# EAGLE schematic MainAutobike (EAGLE 7.3.0)

## Sheet 1 of 6
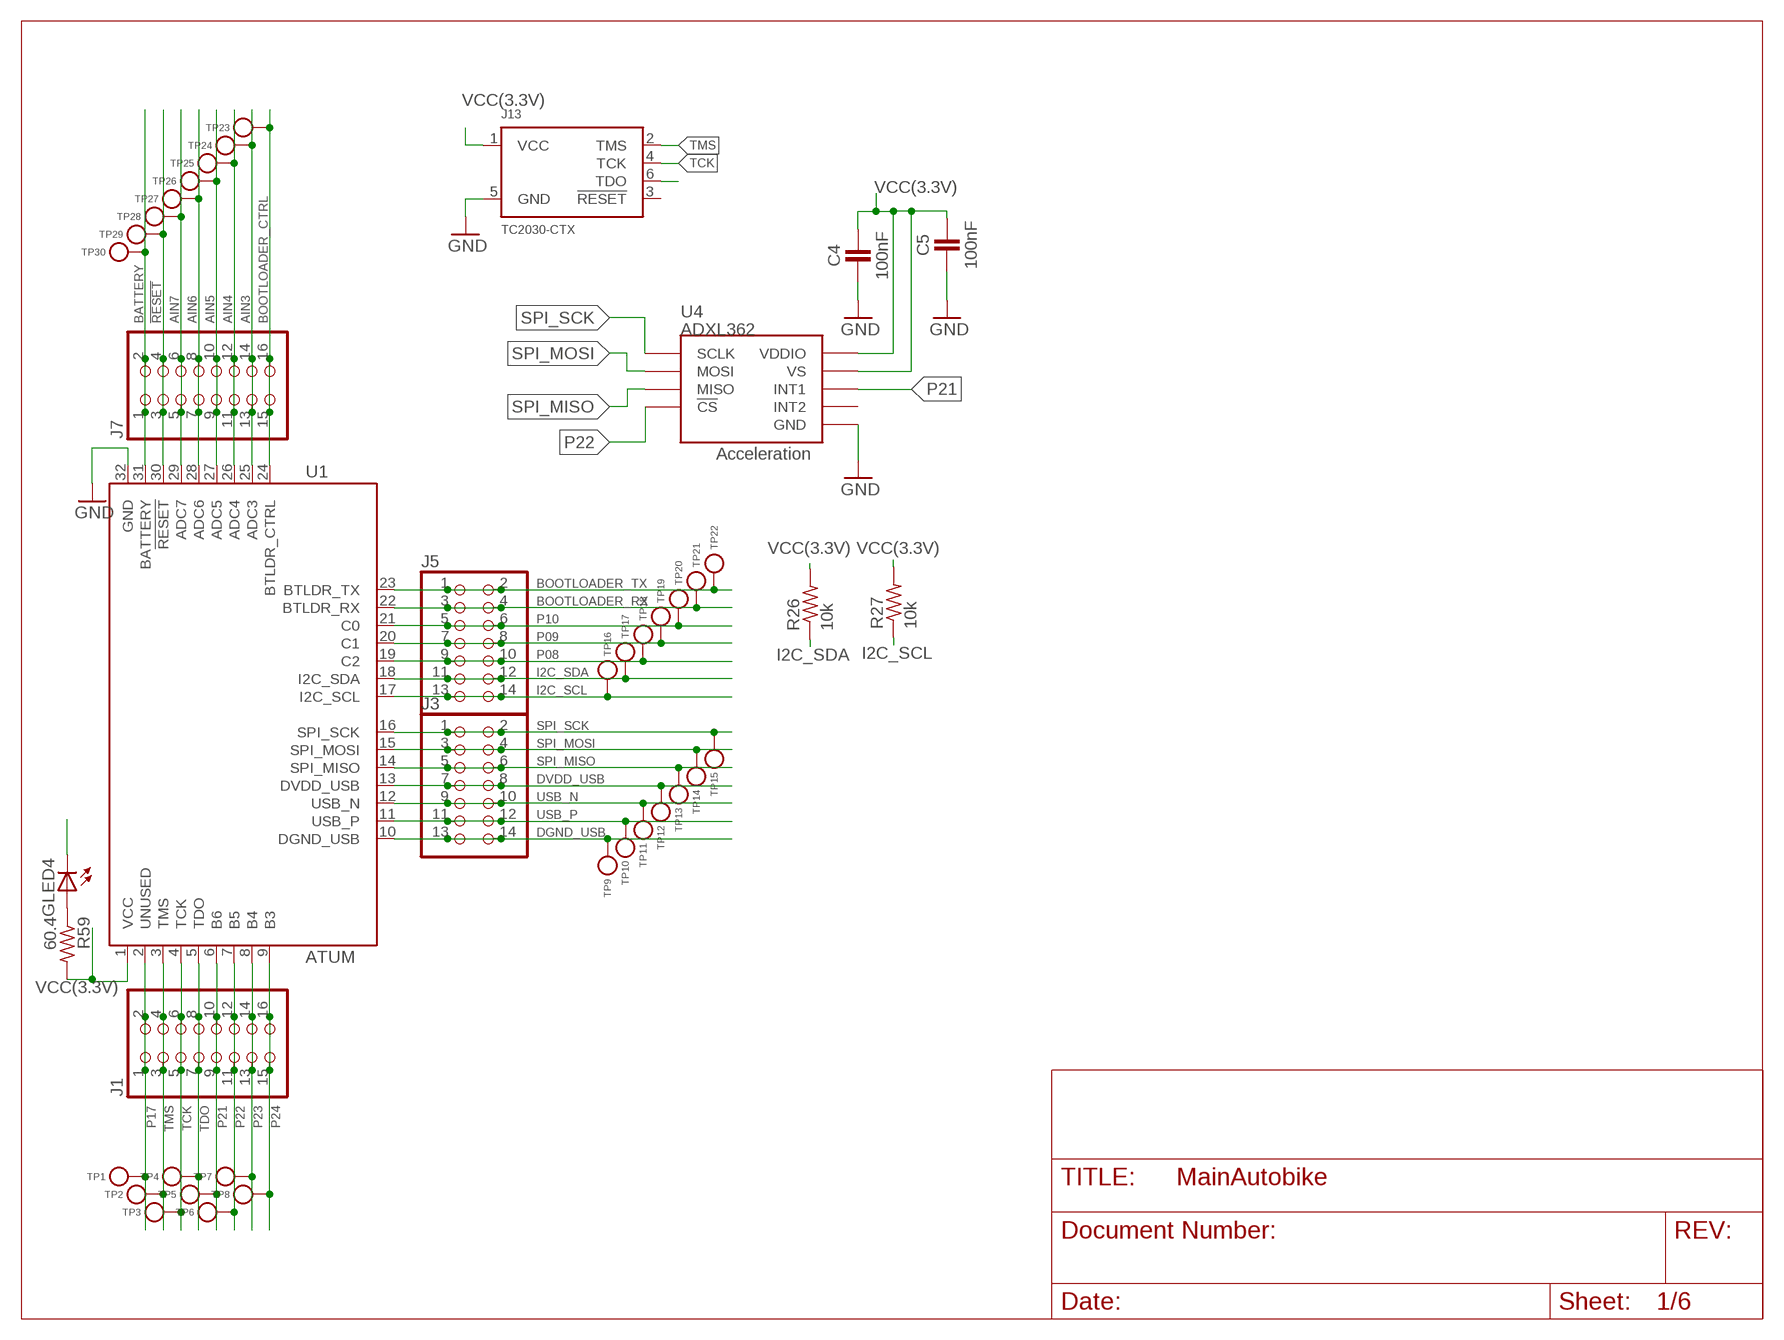
[diagram p0: schematic, sheet 1]

### Parts
C4  100nF  CAPACITOR  [0402_CAP]
C5  100nF  CAPACITOR  [0402_CAP]
GLED4  LEDCHIP-LED0603  [CHIP-LED0603]
J1  PINHD-2X8  [2X08]
J3  PINHD-2X7  [2X07]
J5  PINHD-2X7  [2X07]
J7  PINHD-2X8  [2X08]
J13  TC2030-CTX  [TC2030-IDC]
R26  10k  R-US_R0603  [R0603]
R27  10k  R-US_R0603  [R0603]
R59  60.4  R-US_R0402  [R0402]
TP1  TEST_POINT_0.040IN  [TESTPOINT_0.040IN]
TP2  TEST_POINT_0.040IN  [TESTPOINT_0.040IN]
TP3  TEST_POINT_0.040IN  [TESTPOINT_0.040IN]
TP4  TEST_POINT_0.040IN  [TESTPOINT_0.040IN]
TP5  TEST_POINT_0.040IN  [TESTPOINT_0.040IN]
TP6  TEST_POINT_0.040IN  [TESTPOINT_0.040IN]
TP7  TEST_POINT_0.040IN  [TESTPOINT_0.040IN]
TP8  TEST_POINT_0.040IN  [TESTPOINT_0.040IN]
TP9  TEST_POINT_0.040IN  [TESTPOINT_0.040IN]
TP10  TEST_POINT_0.040IN  [TESTPOINT_0.040IN]
TP11  TEST_POINT_0.040IN  [TESTPOINT_0.040IN]
TP12  TEST_POINT_0.040IN  [TESTPOINT_0.040IN]
TP13  TEST_POINT_0.040IN  [TESTPOINT_0.040IN]
TP14  TEST_POINT_0.040IN  [TESTPOINT_0.040IN]
TP15  TEST_POINT_0.040IN  [TESTPOINT_0.040IN]
TP16  TEST_POINT_0.040IN  [TESTPOINT_0.040IN]
TP17  TEST_POINT_0.040IN  [TESTPOINT_0.040IN]
TP18  TEST_POINT_0.040IN  [TESTPOINT_0.040IN]
TP19  TEST_POINT_0.040IN  [TESTPOINT_0.040IN]
TP20  TEST_POINT_0.040IN  [TESTPOINT_0.040IN]
TP21  TEST_POINT_0.040IN  [TESTPOINT_0.040IN]
TP22  TEST_POINT_0.040IN  [TESTPOINT_0.040IN]
TP23  TEST_POINT_0.040IN  [TESTPOINT_0.040IN]
TP24  TEST_POINT_0.040IN  [TESTPOINT_0.040IN]
TP25  TEST_POINT_0.040IN  [TESTPOINT_0.040IN]
TP26  TEST_POINT_0.040IN  [TESTPOINT_0.040IN]
TP27  TEST_POINT_0.040IN  [TESTPOINT_0.040IN]
TP28  TEST_POINT_0.040IN  [TESTPOINT_0.040IN]
TP29  TEST_POINT_0.040IN  [TESTPOINT_0.040IN]
TP30  TEST_POINT_0.040IN  [TESTPOINT_0.040IN]
U1  ATUM  [ATUM]
U4  ADXL362  [ADXL362]

### Nets
!RESET: J7.3 J7.4 TP29.TESTPOINT U1.30(!RESET)
AIN3: J7.13 J7.14 TP24.TESTPOINT U1.25(ADC3) ; also sheet 3
AIN4: J7.11 J7.12 TP25.TESTPOINT U1.26(ADC4) ; also sheet 3
AIN5: J7.9 J7.10 TP26.TESTPOINT U1.27(ADC5) ; also sheet 5
AIN6: J7.7 J7.8 TP27.TESTPOINT U1.28(ADC6) ; also sheet 5
AIN7: J7.5 J7.6 TP28.TESTPOINT U1.29(ADC7) ; also sheet 5
BATTERY: J7.1 J7.2 TP30.TESTPOINT U1.31(BATTERY)
BOOTLOADER_CTRL: J7.15 J7.16 TP23.TESTPOINT U1.24(BTLDR_CTRL)
BOOTLOADER_RX: J5.3 J5.4 TP21.TESTPOINT U1.22(BTLDR_RX)
BOOTLOADER_TX: J5.1 J5.2 TP22.TESTPOINT U1.23(BTLDR_TX)
DGND_USB: J3.13 J3.14 TP9.TESTPOINT U1.10(DGND_USB)
DVDD_USB: J3.7 J3.8 TP12.TESTPOINT U1.13(DVDD_USB)
GND: C4.2 C5.2 GLED4.C J13.5(GND) U1.32(GND) U4.P$12(GND) U4.P$13(GND) U4.P$16(GND) ; also sheet 2,3,4,5
I2C_SCL: J5.13 J5.14 R27.1 TP16.TESTPOINT U1.17(I2C_SCL) ; also sheet 2,3
I2C_SDA: J5.11 J5.12 R26.1 TP17.TESTPOINT U1.18(I2C_SDA) ; also sheet 2,3
N$79: GLED4.A R59.1
P08: J5.9 J5.10 TP18.TESTPOINT U1.19(C2)
P09: J5.7 J5.8 TP19.TESTPOINT U1.20(C1) ; also sheet 3
P10: J5.5 J5.6 TP20.TESTPOINT U1.21(C0) ; also sheet 3
P17: J1.1 J1.2 TP1.TESTPOINT U1.2(UNUSED)
P21: J1.9 J1.10 TP5.TESTPOINT U1.6(B6) U4.P$11(INT1)
P22: J1.11 J1.12 TP6.TESTPOINT U1.7(B5) U4.P$8(!CS)
P23: J1.13 J1.14 TP7.TESTPOINT U1.8(B4)
P24: J1.15 J1.16 TP8.TESTPOINT U1.9(B3)
SPI_MISO: J3.5 J3.6 TP13.TESTPOINT U1.14(SPI_MISO) U4.P$7(MISO)
SPI_MOSI: J3.3 J3.4 TP14.TESTPOINT U1.15(SPI_MOSI) U4.P$6(MOSI)
SPI_SCK: J3.1 J3.2 TP15.TESTPOINT U1.16(SPI_SCK) U4.P$4(SCLK)
TCK: J1.5 J1.6 J13.4(TCK) TP3.TESTPOINT U1.4(TCK)
TDO: J1.7 J1.8 J13.6(TDO) TP4.TESTPOINT U1.5(TDO)
TMS: J1.3 J1.4 J13.2(TMS) TP2.TESTPOINT U1.3(TMS)
USB_N: J3.9 J3.10 TP11.TESTPOINT U1.12(USB_N)
USB_P: J3.11 J3.12 TP10.TESTPOINT U1.11(USB_P)
VCC(3.3V): C4.1 C5.1 J13.1(VCC) R26.2 R27.2 R59.2 U1.1(VCC) U4.P$1(VDDIO) U4.P$14(VS) ; also sheet 2,3,4,5
Unconnected: J13.3(!RESET) U4.P$9(INT2)

### Notes on the sheet
- Acceleration

## Sheet 2 of 6
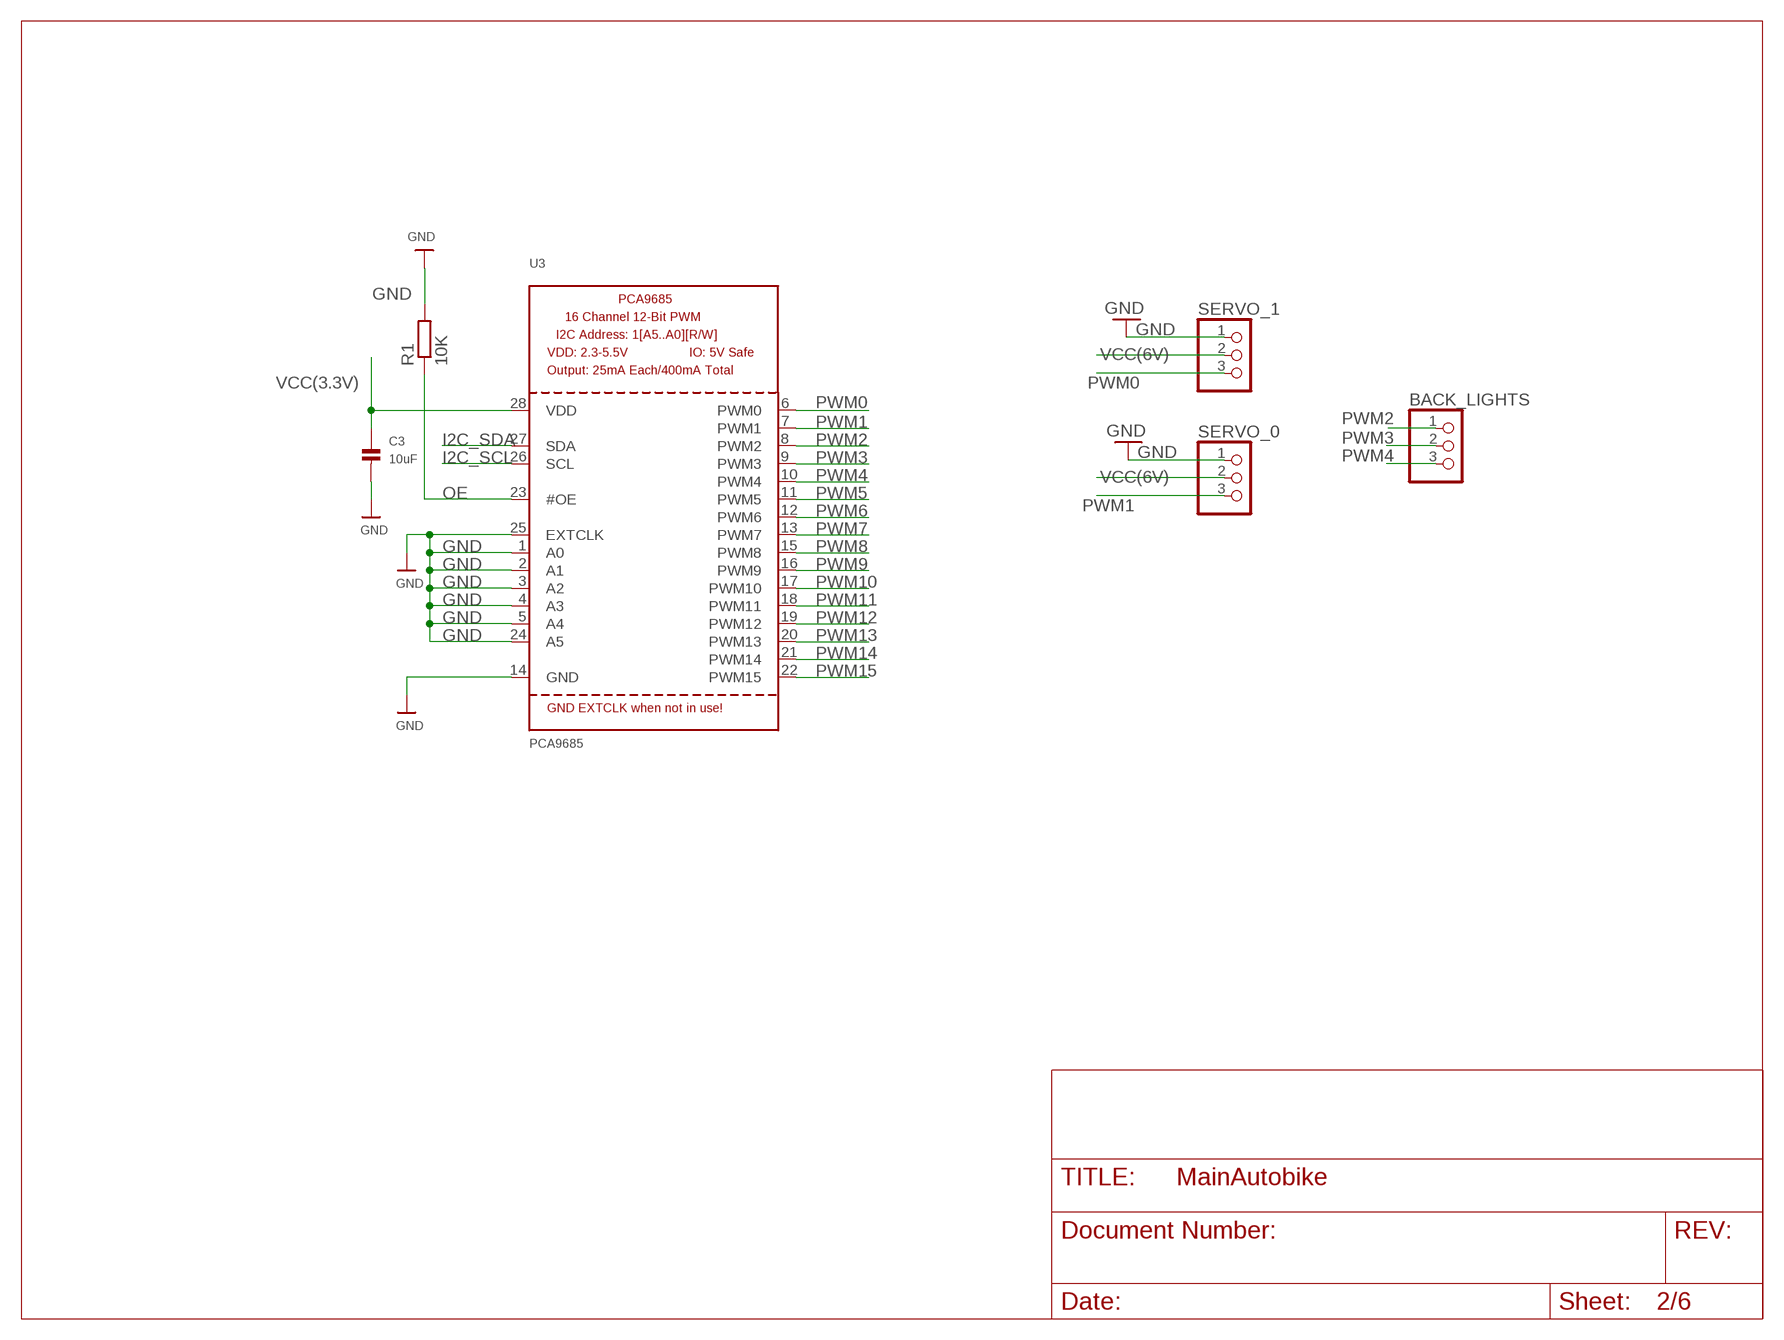
[diagram p1: schematic, sheet 2]

### Parts
BACK_LIGHTS  PINHD-1X3  [1X03]
C3  10uF  CAP_CERAMIC0805  [0805]
R1  10K  R-EU_R0603  [R0603]
SERVO_0  PINHD-1X3  [1X03]
SERVO_1  PINHD-1X3  [1X03]
U3  PCA9685  [TSSOP28]

### Nets
GND: C3.2 R1.2 SERVO_0.1 SERVO_1.1 U3.1(A0) U3.2(A1) U3.3(A2) U3.4(A3) U3.5(A4) U3.14(GND) U3.24(A5) U3.25(EXTCLK) ; also sheet 1,3,4,5
I2C_SCL: U3.26(SCL) ; also sheet 1,3
I2C_SDA: U3.27(SDA) ; also sheet 1,3
OE: R1.1 U3.23(#OE)
PWM0: SERVO_1.3 U3.6(PWM0)
PWM1: SERVO_0.3 U3.7(PWM1)
PWM2: BACK_LIGHTS.1 U3.8(PWM2)
PWM3: BACK_LIGHTS.2 U3.9(PWM3)
PWM4: BACK_LIGHTS.3 U3.10(PWM4)
PWM5: U3.11(PWM5)
PWM6: U3.12(PWM6)
PWM7: U3.13(PWM7)
PWM8: U3.15(PWM8)
PWM9: U3.16(PWM9)
PWM10: U3.17(PWM10)
PWM11: U3.18(PWM11)
PWM12: U3.19(PWM12)
PWM13: U3.20(PWM13)
PWM14: U3.21(PWM14)
PWM15: U3.22(PWM15)
VCC(3.3V): C3.1 U3.28(VDD) ; also sheet 1,3,4,5
VCC(6V): SERVO_0.2 SERVO_1.2 ; also sheet 4

## Sheet 3 of 6
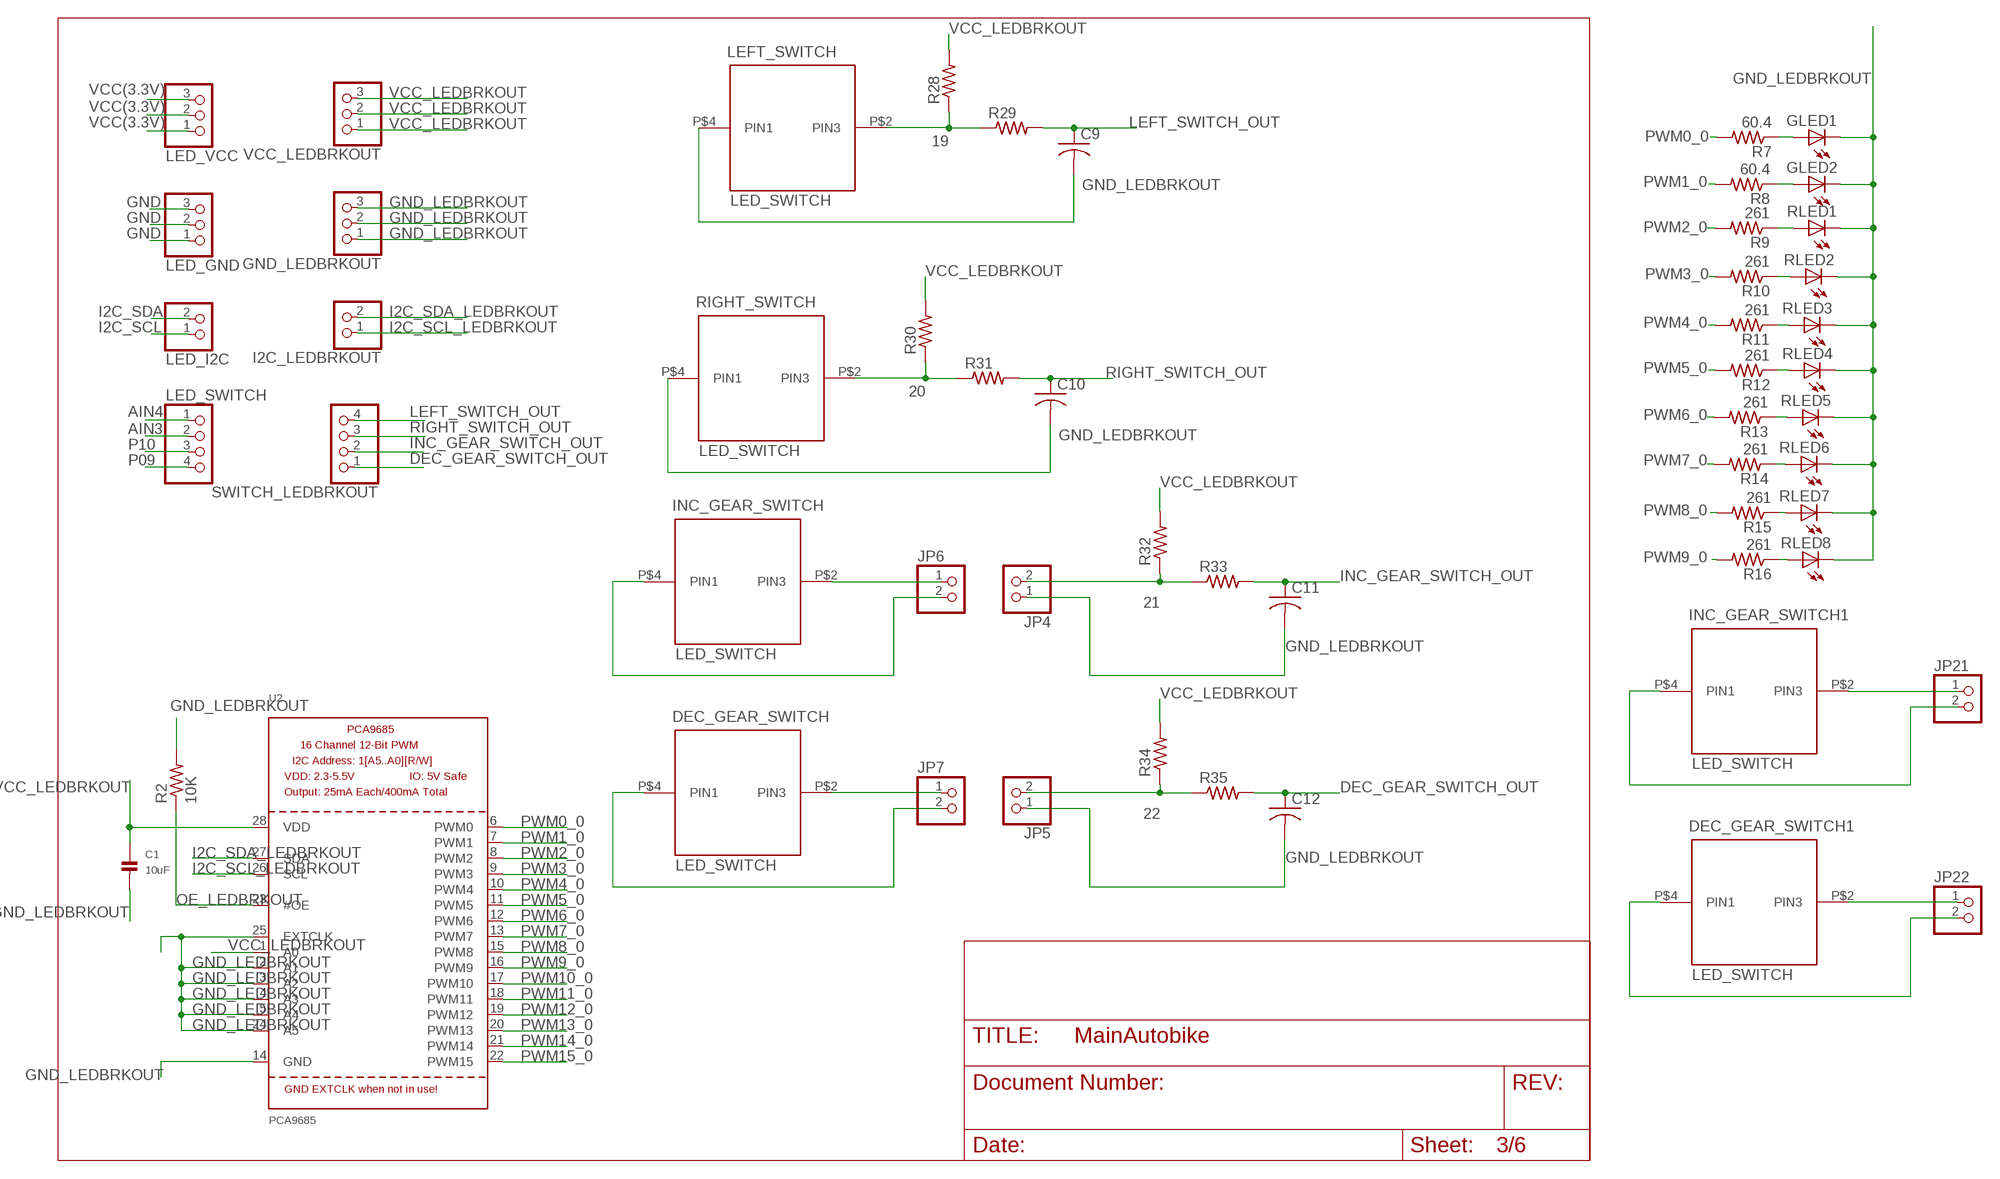
[diagram p2: schematic, sheet 3]

### Parts
C1  10uF  CAP_CERAMIC0805  [0805]
C9  C-USC0402  [C0402]
C10  C-USC0402  [C0402]
C11  C-USC0402  [C0402]
C12  C-USC0402  [C0402]
DEC_GEAR_SWITCH  LED_SWITCH  [LED_SWITCH]
DEC_GEAR_SWITCH1  LED_SWITCH  [LED_SWITCH]
GLED1  LEDCHIP-LED0603  [CHIP-LED0603]
GLED2  LEDCHIP-LED0603  [CHIP-LED0603]
GND_LEDBRKOUT  PINHD-1X3  [1X03]
I2C_LEDBRKOUT  PINHD-1X2  [1X02]
INC_GEAR_SWITCH  LED_SWITCH  [LED_SWITCH]
INC_GEAR_SWITCH1  LED_SWITCH  [LED_SWITCH]
JP4  PINHD-1X2  [1X02]
JP5  PINHD-1X2  [1X02]
JP6  PINHD-1X2  [1X02]
JP7  PINHD-1X2  [1X02]
JP21  PINHD-1X2  [1X02]
JP22  PINHD-1X2  [1X02]
LED_GND  PINHD-1X3  [1X03]
LED_I2C  PINHD-1X2  [1X02]
LED_SWITCH  PINHD-1X4  [1X04]
LED_VCC  PINHD-1X3  [1X03]
LEFT_SWITCH  LED_SWITCH  [LED_SWITCH]
R2  10K  R-US_R0603  [R0603]
R7  60.4  R-US_R0402  [R0402]
R8  60.4  R-US_R0402  [R0402]
R9  261  R-US_R0402  [R0402]
R10  261  R-US_R0402  [R0402]
R11  261  R-US_R0402  [R0402]
R12  261  R-US_R0402  [R0402]
R13  261  R-US_R0402  [R0402]
R14  261  R-US_R0402  [R0402]
R15  261  R-US_R0402  [R0402]
R16  261  R-US_R0402  [R0402]
R28  R-US_R0402  [R0402]
R29  R-US_R0402  [R0402]
R30  R-US_R0402  [R0402]
R31  R-US_R0402  [R0402]
R32  R-US_R0402  [R0402]
R33  R-US_R0402  [R0402]
R34  R-US_R0402  [R0402]
R35  R-US_R0402  [R0402]
RIGHT_SWITCH  LED_SWITCH  [LED_SWITCH]
RLED1  LEDCHIP-LED0603  [CHIP-LED0603]
RLED2  LEDCHIP-LED0603  [CHIP-LED0603]
RLED3  LEDCHIP-LED0603  [CHIP-LED0603]
RLED4  LEDCHIP-LED0603  [CHIP-LED0603]
RLED5  LEDCHIP-LED0603  [CHIP-LED0603]
RLED6  LEDCHIP-LED0603  [CHIP-LED0603]
RLED7  LEDCHIP-LED0603  [CHIP-LED0603]
RLED8  LEDCHIP-LED0603  [CHIP-LED0603]
SWITCH_LEDBRKOUT  PINHD-1X4  [1X04]
U2  PCA9685  [TSSOP28]
VCC_LEDBRKOUT  PINHD-1X3  [1X03]

### Nets
19: LEFT_SWITCH.P$2(PIN3) R28.1 R29.1
20: R30.1 R31.1 RIGHT_SWITCH.P$2(PIN3)
21: JP4.2 R32.1 R33.1
22: JP5.2 R34.1 R35.1
AIN3: LED_SWITCH.2 ; also sheet 1
AIN4: LED_SWITCH.1 ; also sheet 1
DEC_GEAR_SWITCH_OUT: C12.1 R35.2 SWITCH_LEDBRKOUT.1
GND: LED_GND.1 LED_GND.2 LED_GND.3 ; also sheet 1,2,4,5
GND_LEDBRKOUT: C1.2 C9.2 C10.2 C11.2 C12.2 GLED1.C GLED2.C GND_LEDBRKOUT.1 GND_LEDBRKOUT.2 GND_LEDBRKOUT.3 JP4.1 JP5.1 LEFT_SWITCH.P$4(PIN1) R2.2 RIGHT_SWITCH.P$4(PIN1) RLED1.C RLED2.C RLED3.C RLED4.C RLED5.C RLED6.C RLED7.C RLED8.C U2.2(A1) U2.3(A2) U2.4(A3) U2.5(A4) U2.14(GND) U2.24(A5) U2.25(EXTCLK)
I2C_SCL: LED_I2C.1 ; also sheet 1,2
I2C_SCL_LEDBRKOUT: I2C_LEDBRKOUT.1 U2.26(SCL)
I2C_SDA: LED_I2C.2 ; also sheet 1,2
I2C_SDA_LEDBRKOUT: I2C_LEDBRKOUT.2 U2.27(SDA)
INC_GEAR_SWITCH_OUT: C11.1 R33.2 SWITCH_LEDBRKOUT.2
LEFT_SWITCH_OUT: C9.1 R29.2 SWITCH_LEDBRKOUT.4
N$1: R16.1 RLED8.A
N$4: R15.1 RLED7.A
N$5: R14.1 RLED6.A
N$6: R13.1 RLED5.A
N$7: R12.1 RLED4.A
N$8: R11.1 RLED3.A
N$9: R10.1 RLED2.A
N$10: R9.1 RLED1.A
N$11: GLED2.A R8.1
N$12: GLED1.A R7.1
N$35: INC_GEAR_SWITCH.P$4(PIN1) JP6.2
N$36: INC_GEAR_SWITCH.P$2(PIN3) JP6.1
N$37: DEC_GEAR_SWITCH.P$4(PIN1) JP7.2
N$38: DEC_GEAR_SWITCH.P$2(PIN3) JP7.1
N$43: INC_GEAR_SWITCH1.P$4(PIN1) JP21.2
N$44: INC_GEAR_SWITCH1.P$2(PIN3) JP21.1
N$45: DEC_GEAR_SWITCH1.P$4(PIN1) JP22.2
N$49: DEC_GEAR_SWITCH1.P$2(PIN3) JP22.1
OE_LEDBRKOUT: R2.1 U2.23(#OE)
P09: LED_SWITCH.4 ; also sheet 1
P10: LED_SWITCH.3 ; also sheet 1
PWM0_0: R7.2 U2.6(PWM0)
PWM1_0: R8.2 U2.7(PWM1)
PWM2_0: R9.2 U2.8(PWM2)
PWM3_0: R10.2 U2.9(PWM3)
PWM4_0: R11.2 U2.10(PWM4)
PWM5_0: R12.2 U2.11(PWM5)
PWM6_0: R13.2 U2.12(PWM6)
PWM7_0: R14.2 U2.13(PWM7)
PWM8_0: R15.2 U2.15(PWM8)
PWM9_0: R16.2 U2.16(PWM9)
PWM10_0: U2.17(PWM10)
PWM11_0: U2.18(PWM11)
PWM12_0: U2.19(PWM12)
PWM13_0: U2.20(PWM13)
PWM14_0: U2.21(PWM14)
PWM15_0: U2.22(PWM15)
RIGHT_SWITCH_OUT: C10.1 R31.2 SWITCH_LEDBRKOUT.3
VCC(3.3V): LED_VCC.1 LED_VCC.2 LED_VCC.3 ; also sheet 1,2,4,5
VCC_LEDBRKOUT: C1.1 R28.2 R30.2 R32.2 R34.2 U2.1(A0) U2.28(VDD) VCC_LEDBRKOUT.1 VCC_LEDBRKOUT.2 VCC_LEDBRKOUT.3

## Sheet 4 of 6
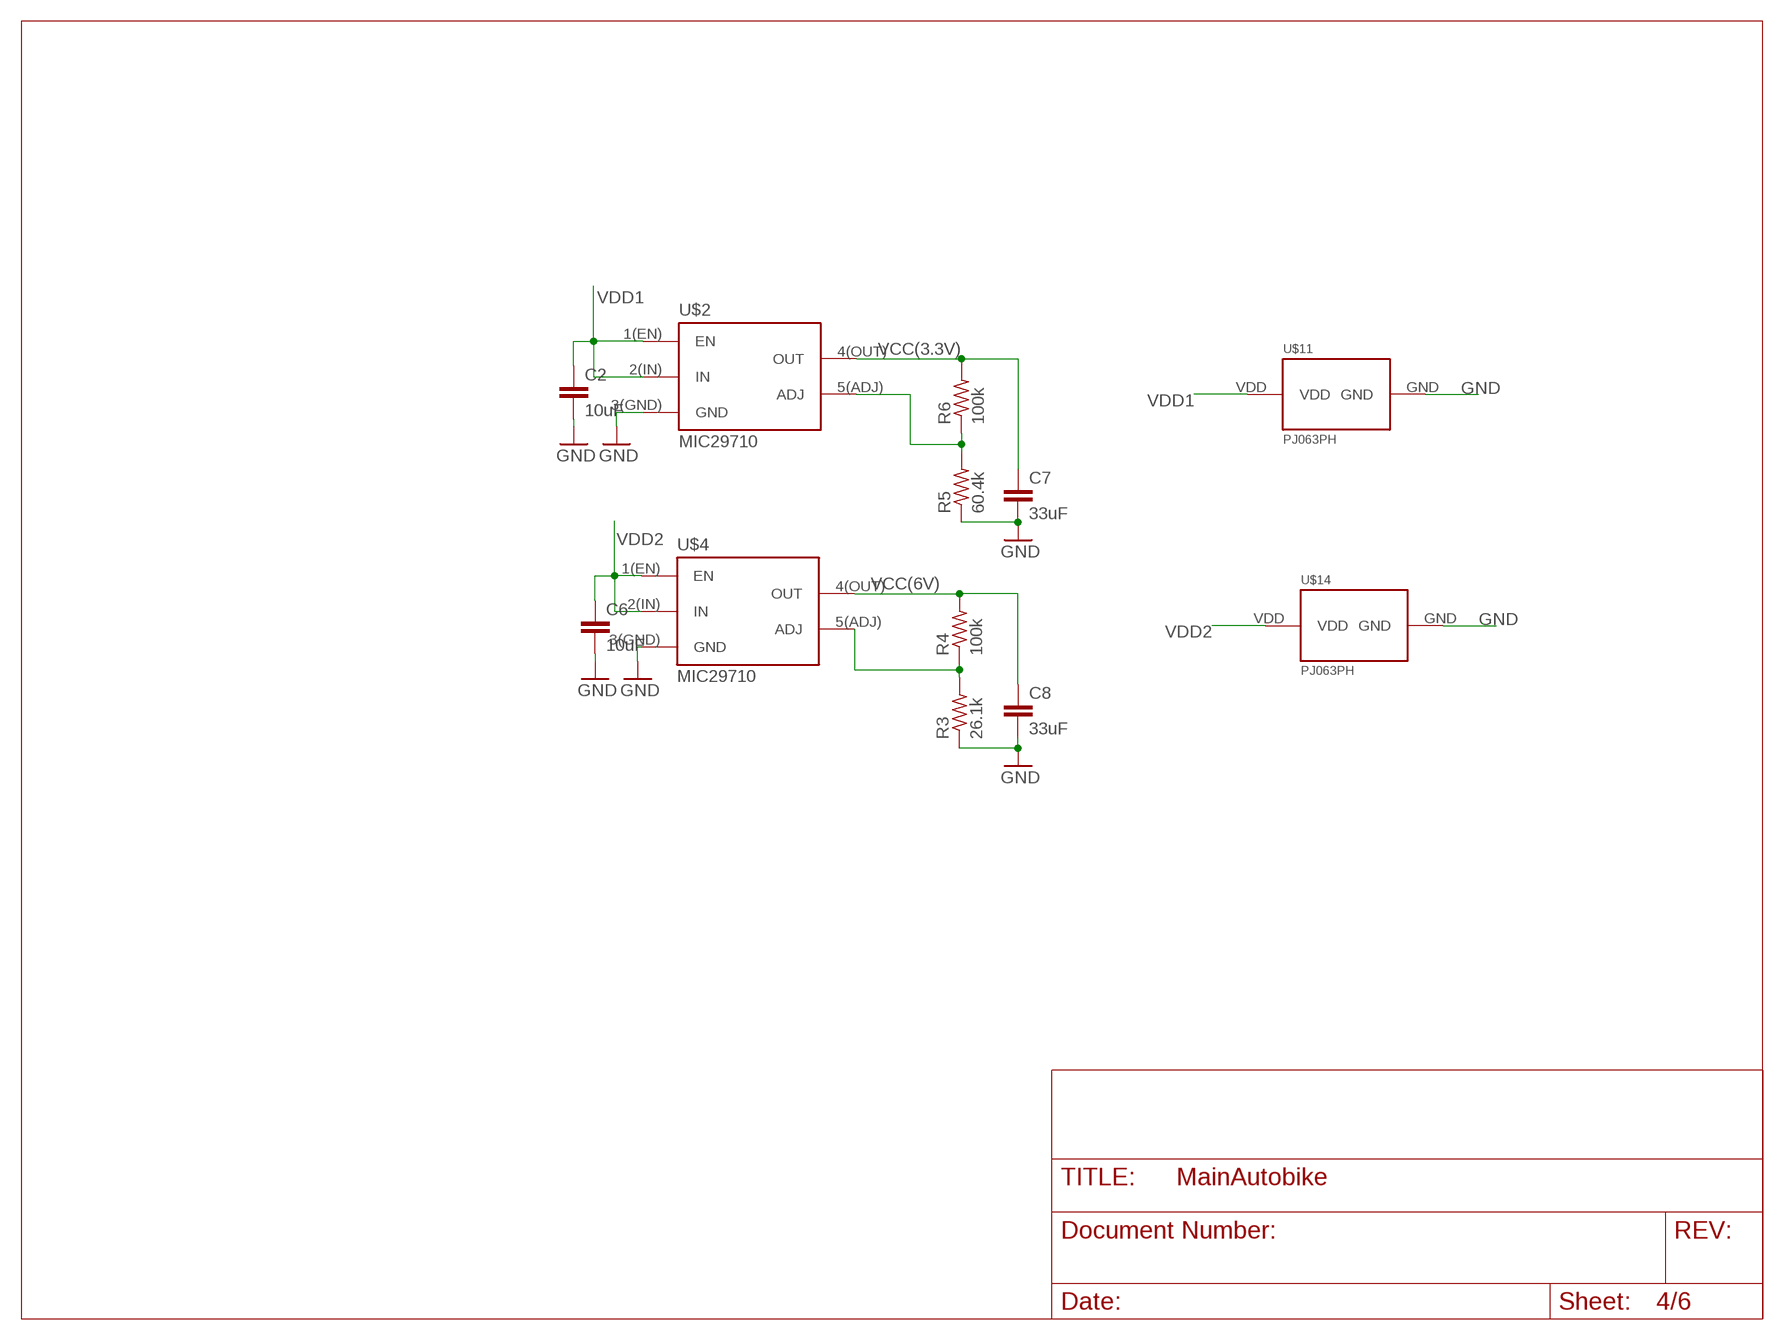
[diagram p3: schematic, sheet 4]

### Parts
C2  10uF  C-EUC0805  [C0805]
C6  10uF  C-EUC0805  [C0805]
C7  33uF  C-EUC0805  [C0805]
C8  33uF  C-EUC0805  [C0805]
R3  26.1k  R-US_R0402  [R0402]
R4  100k  R-US_R0402  [R0402]
R5  60.4k  R-US_R0402  [R0402]
R6  100k  R-US_R0402  [R0402]
U$2  MIC29710  [MIC29710]
U$4  MIC29710  [MIC29710]
U$11  PJ063PH  [PJ063BH]
U$14  PJ063PH  [PJ063BH]

### Nets
GND: C2.2 C6.2 C7.2 C8.2 R3.1 R5.1 U$2.3(GND)(GND) U$4.3(GND)(GND) U$11.GND U$14.GND ; also sheet 1,2,3,5
N$2: R5.2 R6.1 U$2.5(ADJ)(ADJ)
N$3: R3.2 R4.1 U$4.5(ADJ)(ADJ)
VCC(3.3V): C7.1 R6.2 U$2.4(OUT)(OUT) ; also sheet 1,2,3,5
VCC(6V): C8.1 R4.2 U$4.4(OUT)(OUT) ; also sheet 2
VDD1: C2.1 U$2.1(EN)(EN) U$2.2(IN)(IN) U$11.VDD
VDD2: C6.1 U$4.1(EN)(EN) U$4.2(IN)(IN) U$14.VDD

## Sheet 5 of 6
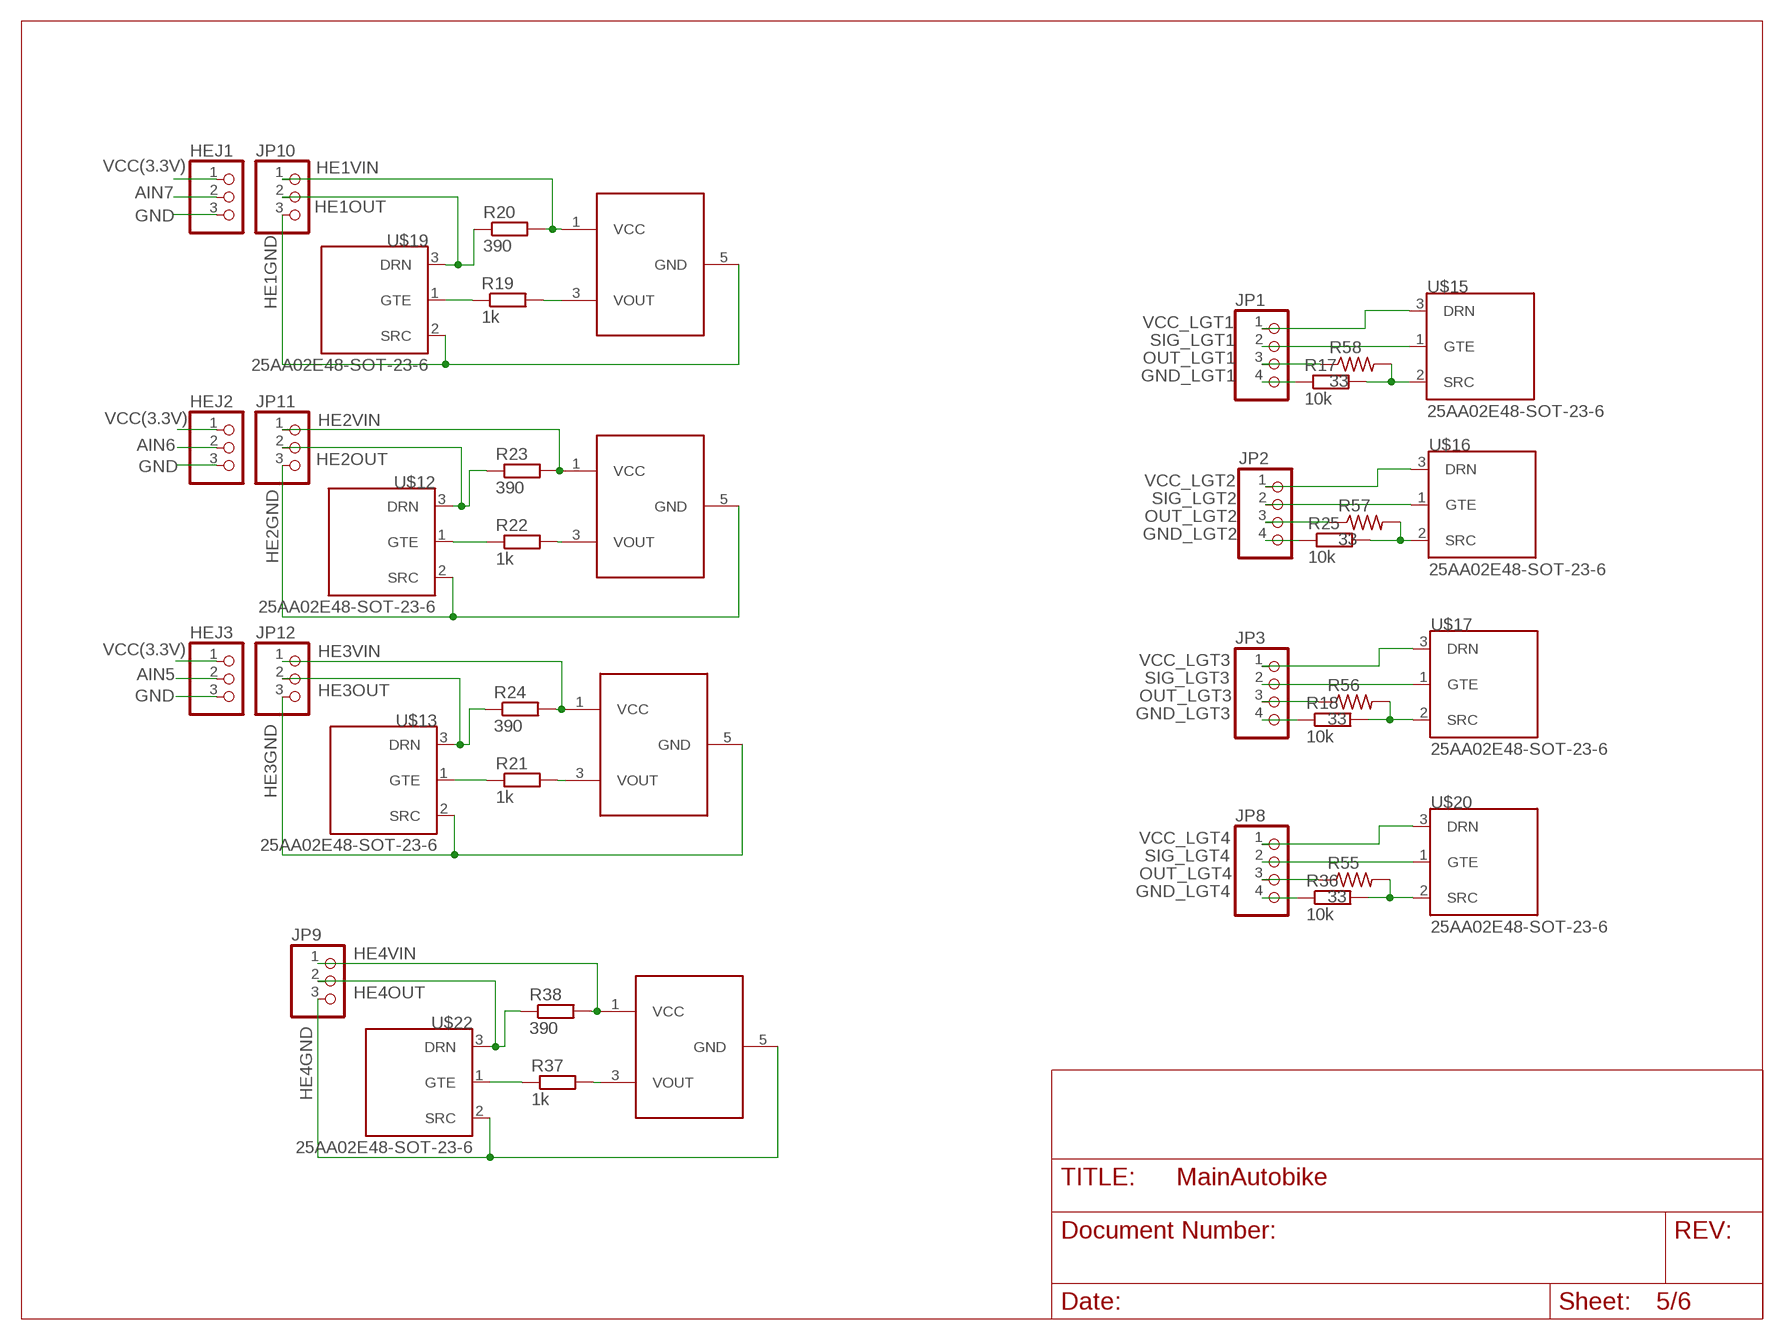
[diagram p4: schematic, sheet 5]

### Parts
HEJ1  PINHD-1X3  [1X03]
HEJ2  PINHD-1X3  [1X03]
HEJ3  PINHD-1X3  [1X03]
JP1  PINHD-1X4  [1X04]
JP2  PINHD-1X4  [1X04]
JP3  PINHD-1X4  [1X04]
JP8  PINHD-1X4  [1X04]
JP9  PINHD-1X3  [1X03]
JP10  PINHD-1X3  [1X03]
JP11  PINHD-1X3  [1X03]
JP12  PINHD-1X3  [1X03]
R17  10k  R-EU_R0603  [R0603]
R18  10k  R-EU_R0603  [R0603]
R19  1k  R-EU_R0603  [R0603]
R20  390  R-EU_R0603  [R0603]
R21  1k  R-EU_R0603  [R0603]
R22  1k  R-EU_R0603  [R0603]
R23  390  R-EU_R0603  [R0603]
R24  390  R-EU_R0603  [R0603]
R25  10k  R-EU_R0603  [R0603]
R36  10k  R-EU_R0603  [R0603]
R37  1k  R-EU_R0603  [R0603]
R38  390  R-EU_R0603  [R0603]
R55  33  R-US_R0402  [R0402]
R56  33  R-US_R0402  [R0402]
R57  33  R-US_R0402  [R0402]
R58  33  R-US_R0402  [R0402]
U$5  HALLEFFECT  [SOT23-6]
U$6  HALLEFFECT  [SOT23-6]
U$12  25AA02E48-SOT-23-6  [SOT23-3]
U$13  25AA02E48-SOT-23-6  [SOT23-3]
U$15  25AA02E48-SOT-23-6  [SOT23-3]
U$16  25AA02E48-SOT-23-6  [SOT23-3]
U$17  25AA02E48-SOT-23-6  [SOT23-3]
U$18  HALLEFFECT  [SOT23-6]
U$19  25AA02E48-SOT-23-6  [SOT23-3]
U$20  25AA02E48-SOT-23-6  [SOT23-3]
U$21  HALLEFFECT  [SOT23-6]
U$22  25AA02E48-SOT-23-6  [SOT23-3]

### Nets
AIN5: HEJ3.2 ; also sheet 1
AIN6: HEJ2.2 ; also sheet 1
AIN7: HEJ1.2 ; also sheet 1
GND: HEJ1.3 HEJ2.3 HEJ3.3 ; also sheet 1,2,3,4
GND_LGT1: JP1.4 R17.1
GND_LGT2: JP2.4 R25.1
GND_LGT3: JP3.4 R18.1
GND_LGT4: JP8.4 R36.1
HE1GND: JP10.3 U$18.5(GND) U$19.2(SRC)
HE1OUT: JP10.2 R20.1 U$19.3(DRN)
HE1VIN: JP10.1 R20.2 U$18.1(VCC)
HE2GND: JP11.3 U$5.5(GND) U$12.2(SRC)
HE2OUT: JP11.2 R23.1 U$12.3(DRN)
HE2VIN: JP11.1 R23.2 U$5.1(VCC)
HE3GND: JP12.3 U$6.5(GND) U$13.2(SRC)
HE3OUT: JP12.2 R24.1 U$13.3(DRN)
HE3VIN: JP12.1 R24.2 U$6.1(VCC)
HE4GND: JP9.3 U$21.5(GND) U$22.2(SRC)
HE4OUT: JP9.2 R38.1 U$22.3(DRN)
HE4VIN: JP9.1 R38.2 U$21.1(VCC)
N$13: R37.1 U$22.1(GTE)
N$14: R37.2 U$21.3(VOUT)
N$15: R19.1 U$19.1(GTE)
N$16: R19.2 U$18.3(VOUT)
N$18: R21.1 U$13.1(GTE)
N$21: R21.2 U$6.3(VOUT)
N$24: R22.1 U$12.1(GTE)
N$25: R22.2 U$5.3(VOUT)
N$33: JP8.3 R55.1
N$34: JP3.3 R56.1
N$39: JP2.3 R57.1
N$42: JP1.3 R58.1
OUT_LGT1: R17.2 R58.2 U$15.2(SRC)
OUT_LGT2: R25.2 R57.2 U$16.2(SRC)
OUT_LGT3: R18.2 R56.2 U$17.2(SRC)
OUT_LGT4: R36.2 R55.2 U$20.2(SRC)
SIG_LGT1: JP1.2 U$15.1(GTE)
SIG_LGT2: JP2.2 U$16.1(GTE)
SIG_LGT3: JP3.2 U$17.1(GTE)
SIG_LGT4: JP8.2 U$20.1(GTE)
VCC(3.3V): HEJ1.1 HEJ2.1 HEJ3.1 ; also sheet 1,2,3,4
VCC_LGT1: JP1.1 U$15.3(DRN)
VCC_LGT2: JP2.1 U$16.3(DRN)
VCC_LGT3: JP3.1 U$17.3(DRN)
VCC_LGT4: JP8.1 U$20.3(DRN)

## Sheet 6 of 6
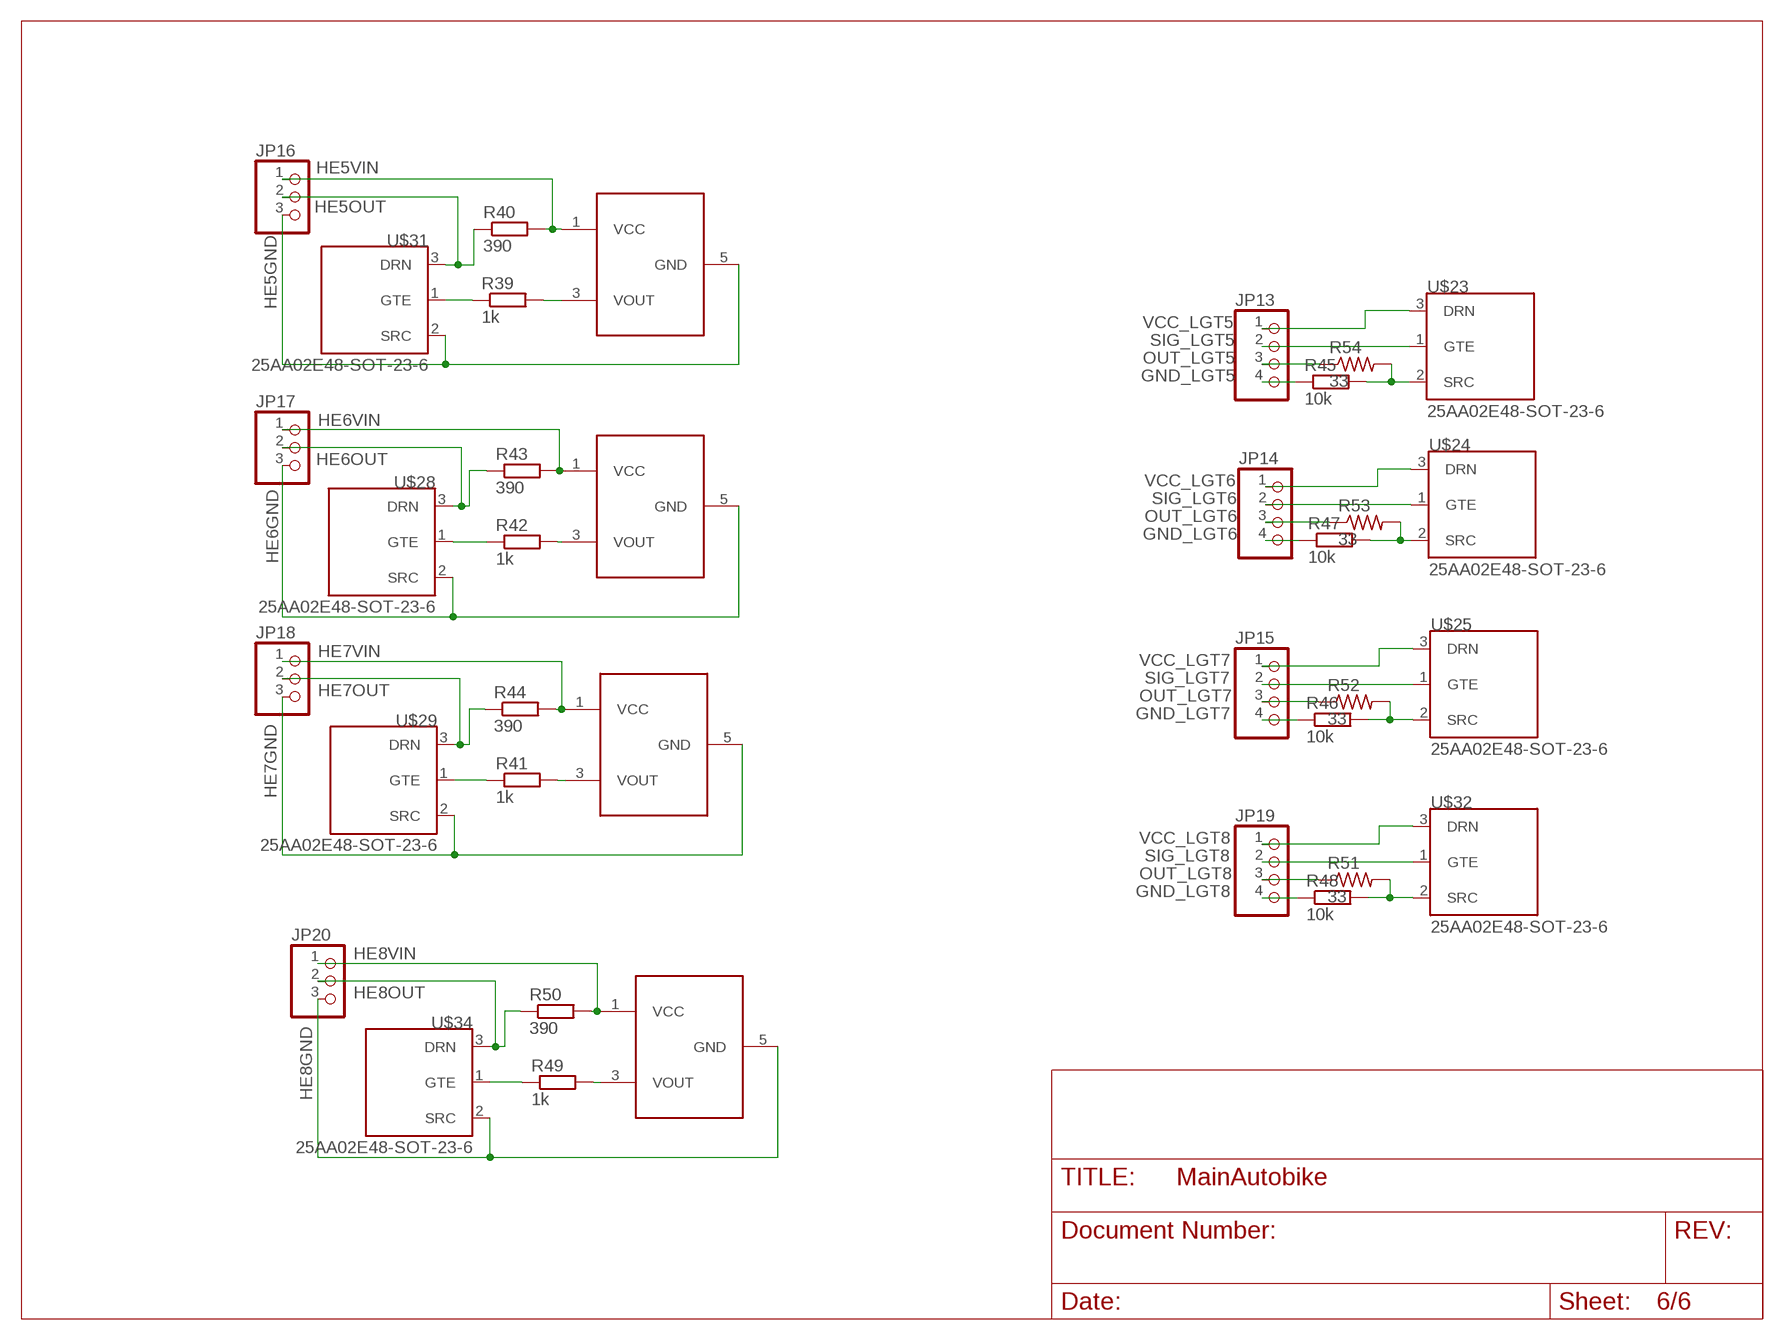
[diagram p5: schematic, sheet 6]

### Parts
JP13  PINHD-1X4  [1X04]
JP14  PINHD-1X4  [1X04]
JP15  PINHD-1X4  [1X04]
JP16  PINHD-1X3  [1X03]
JP17  PINHD-1X3  [1X03]
JP18  PINHD-1X3  [1X03]
JP19  PINHD-1X4  [1X04]
JP20  PINHD-1X3  [1X03]
R39  1k  R-EU_R0603  [R0603]
R40  390  R-EU_R0603  [R0603]
R41  1k  R-EU_R0603  [R0603]
R42  1k  R-EU_R0603  [R0603]
R43  390  R-EU_R0603  [R0603]
R44  390  R-EU_R0603  [R0603]
R45  10k  R-EU_R0603  [R0603]
R46  10k  R-EU_R0603  [R0603]
R47  10k  R-EU_R0603  [R0603]
R48  10k  R-EU_R0603  [R0603]
R49  1k  R-EU_R0603  [R0603]
R50  390  R-EU_R0603  [R0603]
R51  33  R-US_R0402  [R0402]
R52  33  R-US_R0402  [R0402]
R53  33  R-US_R0402  [R0402]
R54  33  R-US_R0402  [R0402]
U$23  25AA02E48-SOT-23-6  [SOT23-3]
U$24  25AA02E48-SOT-23-6  [SOT23-3]
U$25  25AA02E48-SOT-23-6  [SOT23-3]
U$26  HALLEFFECT  [SOT23-6]
U$27  HALLEFFECT  [SOT23-6]
U$28  25AA02E48-SOT-23-6  [SOT23-3]
U$29  25AA02E48-SOT-23-6  [SOT23-3]
U$30  HALLEFFECT  [SOT23-6]
U$31  25AA02E48-SOT-23-6  [SOT23-3]
U$32  25AA02E48-SOT-23-6  [SOT23-3]
U$33  HALLEFFECT  [SOT23-6]
U$34  25AA02E48-SOT-23-6  [SOT23-3]

### Nets
GND_LGT5: JP13.4 R45.1
GND_LGT6: JP14.4 R47.1
GND_LGT7: JP15.4 R46.1
GND_LGT8: JP19.4 R48.1
HE5GND: JP16.3 U$30.5(GND) U$31.2(SRC)
HE5OUT: JP16.2 R40.1 U$31.3(DRN)
HE5VIN: JP16.1 R40.2 U$30.1(VCC)
HE6GND: JP17.3 U$26.5(GND) U$28.2(SRC)
HE6OUT: JP17.2 R43.1 U$28.3(DRN)
HE6VIN: JP17.1 R43.2 U$26.1(VCC)
HE7GND: JP18.3 U$27.5(GND) U$29.2(SRC)
HE7OUT: JP18.2 R44.1 U$29.3(DRN)
HE7VIN: JP18.1 R44.2 U$27.1(VCC)
HE8GND: JP20.3 U$33.5(GND) U$34.2(SRC)
HE8OUT: JP20.2 R50.1 U$34.3(DRN)
HE8VIN: JP20.1 R50.2 U$33.1(VCC)
N$17: R39.1 U$31.1(GTE)
N$19: R39.2 U$30.3(VOUT)
N$20: R41.1 U$29.1(GTE)
N$22: R41.2 U$27.3(VOUT)
N$23: R42.1 U$28.1(GTE)
N$26: R42.2 U$26.3(VOUT)
N$27: R49.1 U$34.1(GTE)
N$28: R49.2 U$33.3(VOUT)
N$29: JP19.3 R51.1
N$30: JP15.3 R52.1
N$31: JP14.3 R53.1
N$32: JP13.3 R54.1
OUT_LGT5: R45.2 R54.2 U$23.2(SRC)
OUT_LGT6: R47.2 R53.2 U$24.2(SRC)
OUT_LGT7: R46.2 R52.2 U$25.2(SRC)
OUT_LGT8: R48.2 R51.2 U$32.2(SRC)
SIG_LGT5: JP13.2 U$23.1(GTE)
SIG_LGT6: JP14.2 U$24.1(GTE)
SIG_LGT7: JP15.2 U$25.1(GTE)
SIG_LGT8: JP19.2 U$32.1(GTE)
VCC_LGT5: JP13.1 U$23.3(DRN)
VCC_LGT6: JP14.1 U$24.3(DRN)
VCC_LGT7: JP15.1 U$25.3(DRN)
VCC_LGT8: JP19.1 U$32.3(DRN)

## Library data of the parts
BACK_LIGHTS GND_LEDBRKOUT HEJ1-HEJ3 JP9-JP12 JP16-JP18 JP20 LED_GND LED_VCC SERVO_0 SERVO_1 VCC_LEDBRKOUT = pinhead:PINHD-1X3: PIN HEADER
C1 C3 = microbuilder:CAP_CERAMIC: Ceramic Capacitors 0402 - 0402 Surface Mount Capacitors 16pF 50V 5% [Digikey: 445-4899-2-ND] 18pF 50V 5% [Digikey: 490-1281-2-ND] 22pF 50V 5% [Digikey: 490-1283-2-ND] 68pF 50V 5% [Digikey: 490-1289-2-ND] 0.1uF 10V 10% [Digikey: 490-1318-2-ND] 1.0uF 6.3V 10% [Digikey: 490-1320-2-ND] 0603 - 0603 Surface Mount Capacitors 16 pF 50V 5% [Digikey: 445-5051-2-ND] 22 pF 50V [Digikey: PCC220ACVTR-ND] 33 pF 50V 5% [Digikey: 490-1415-1-ND] 56pF 50V 5% [Digikey: 490-1421-1-ND] 220pF 50V 5% [Digikey: 445-1285-1-ND] 680 pF 50V 2200 pF 50V 5% C0G [Digikey: 445-1297-1-ND] 5600 pF 100V 5% X7R [Digikey: 478-3711-1-ND] 0.1 µF 25V 10% [Digikey: PCC2277TR-ND] 0.22 µF 16V 10% X7R [Digikey: 445-1318-1-ND] 1.0 µF 25V 10% [Digikey: 445-5146-2-ND] 0603 - RF Specific 3pF 250V +/-0.1pF RF [Digikey: 712-1347-1-ND] 18 pF 250V 5% [Digikey: 478-3505-1-ND or 712-1322-1-ND] 56 pF 250V 5% C0G RF [Digikey: 490-4867-1-ND] 68 pF 250V RF [Digikey: 490-4868-1-ND] 0805 - 0805 Surface Mount Capacitors 220 pF 250V 2% RF Ceramic Capacitor [Digikey: 712-1398-1-ND] 1000 pF 50V 2% NP0 Ceramic Capacitor [Digikey: 478-3760-1-ND] 0.1 µF 25V 10% Ceramic Capacitor [Digikey: PCC1828TR-ND] 1.0 µF 16V 10% Ceramic Capacitor[Digikey: 490-1691-2-ND] 10.0 µF 10V 10% Ceramic Capacitor[Digikey: 709-1228-1-ND] 10.0 uF 16V 10% Ceramic Capacitor [Digikey: 478-5165-2-ND] 47 uF 6.3V 20% Ceramic Capacitor [Digikey: 587-1779-1-ND or 399-5506-1-ND] 1206 - 1206 Surface Mount Capacitors 47uF 10V 20% Ceramic Capacitor [Digikey: 490-5528-1-ND or 399-5508-1-ND or 445-6010-1-ND] 100uF 6.3V -20%, +80% Y5V Ceramic Capacitor (Digikey: 490-4512-1-ND, Mouser: 81-GRM31CF50J107ZE1L)
C2 C6-C8 = rcl:C-EU: CAPACITOR, European symbol
C4 C5 = passives:CAPACITOR: 0402 Capacitor
C9-C12 = rcl:C-US: CAPACITOR, American symbol
DEC_GEAR_SWITCH DEC_GEAR_SWITCH1 INC_GEAR_SWITCH INC_GEAR_SWITCH1 LEFT_SWITCH RIGHT_SWITCH = led_switch:LED_SWITCH
GLED1 GLED2 GLED4 RLED1-RLED8 = led:LED: LED OSRAM: - CHIPLED LG R971, LG N971, LY N971, LG Q971, LY Q971, LO R971, LY R971 LH N974, LH R974 LS Q976, LO Q976, LY Q976 LO Q996 - Hyper CHIPLED LW Q18S LB Q993, LB Q99A, LB R99A - SideLED LS A670, LO A670, LY A670, LG A670, LP A670 LB A673, LV A673, LT A673, LW A673 LH A674 LY A675 LS A676, LA A676, LO A676, LY A676, LW A676 LS A679, LY A679, LG A679 - Hyper Micro SIDELED® LS Y876, LA Y876, LO Y876, LY Y876 LT Y87S - SmartLED LW L88C, LW L88S LB L89C, LB L89S, LG L890 LS L89K, LO L89K, LY L89K LS L896, LA L896, LO L896, LY L896 - TOPLED LS T670, LO T670, LY T670, LG T670, LP T670 LSG T670, LSP T670, LSY T670, LOP T670, LYG T670 LG T671, LOG T671, LSG T671 LB T673, LV T673, LT T673, LW T673 LH T674 LS T676, LA T676, LO T676, LY T676, LB T676, LH T676, LSB T676, LW T676 LB T67C, LV T67C, LT T67C, LS T67K, LO T67K, LY T67K, LW E67C LS E67B, LA E67B, LO E67B, LY E67B, LB E67C, LV E67C, LT E67C LW T67C LS T679, LY T679, LG T679 LS T770, LO T770, LY T770, LG T770, LP T770 LB T773, LV T773, LT T773, LW T773 LH T774 LS E675, LA E675, LY E675, LS T675 LS T776, LA T776, LO T776, LY T776, LB T776 LHGB T686 LT T68C, LB T68C - Hyper Mini TOPLED® LB M676 - Mini TOPLED Santana® LG M470 LS M47K, LO M47K, LY M47K Source: http://www.osram.convergy.de LUXEON: - LUMILED® LXK2-PW12-R00, LXK2-PW12-S00, LXK2-PW14-U00, LXK2-PW14-V00 LXK2-PM12-R00, LXK2-PM12-S00, LXK2-PM14-U00 LXK2-PE12-Q00, LXK2-PE12-R00, LXK2-PE12-S00, LXK2-PE14-T00, LXK2-PE14-U00 LXK2-PB12-K00, LXK2-PB12-L00, LXK2-PB12-M00, LXK2-PB14-N00, LXK2-PB14-P00, LXK2-PB14-Q00 LXK2-PR12-L00, LXK2-PR12-M00, LXK2-PR14-Q00, LXK2-PR14-R00 LXK2-PD12-Q00, LXK2-PD12-R00, LXK2-PD12-S00 LXK2-PH12-R00, LXK2-PH12-S00 LXK2-PL12-P00, LXK2-PL12-Q00, LXK2-PL12-R00 Source: www.luxeon.com KINGBRIGHT: KA-3528ASYC Source: www.kingbright.com
I2C_LEDBRKOUT JP4-JP7 JP21 JP22 LED_I2C = pinhead:PINHD-1X2: PIN HEADER
J1 J7 = pinhead:PINHD-2X8: PIN HEADER; DIGIKEY: 609-3364-ND; MOUSER: 649-68602-116HLF; NEWARK: 20M2833
J3 J5 = pinhead:PINHD-2X7: PIN HEADER; DIGIKEY: 609-3491-ND; MOUSER: 649-67996-114HLF; NEWARK: 30M1973
J13 = connector:TC2030-CTX: Tag Connect footprint for ARM JTAG. 10 pin ARM Cortex Debug Connector.
JP1-JP3 JP8 JP13-JP15 JP19 LED_SWITCH SWITCH_LEDBRKOUT = pinhead:PINHD-1X4: PIN HEADER
R1 R17-R25 R36-R50 = rcl:R-EU_: RESISTOR, European symbol
R2-R16 R26-R35 R51-R59 = rcl:R-US_: RESISTOR, American symbol
TP1-TP30 = headers:TEST_POINT_0.040IN: 0.040in Test Point; DIGIKEY: 5001K-ND
U1 = atum:ATUM: Atum sensorboard prototyping module.
U2 U3 = microbuilder:PCA9685: PCA9685 - 16 Channel 12-Bit I2C PWM Controller 5.0V tolerant 16 channel, 12-bit I2C PWM controller with 25mA per output (max. 400mA total) Digikey: 568-5931-1-ND
U4 = SparkFun-Sensors:ADXL362: Micropower 3-axis accelerometer 2/4/8g digital output (SPI)
U$2 U$4 = MIC29710_new2:MIC29710
U$5 U$6 U$18 U$21 U$26 U$27 U$30 U$33 = 25AA02E48:HALLEFFECT
U$11 U$14 = PJ063PH:PJ063PH
U$12 U$13 U$15-U$17 U$19 U$20 U$22-U$25 U$28 U$29 U$31 U$32 U$34 = 25AA02E48:25AA02E48-SOT-23-6: 25AA02E48 2K SPI Bus Serial EEPROM With Unique Ethernet MAC Address Density: 2 Kbit (x8) Max. Clock Freq.: 10 MHz Page Size (bytes): 16 Endurance: 1,000,000 Op. Volt Range (V): 1.8 to 5.5 Temp Range (°C): -40°C to +85°C